# EAGLE design Strombegrenzung_RevB (EAGLE 7.4.0)
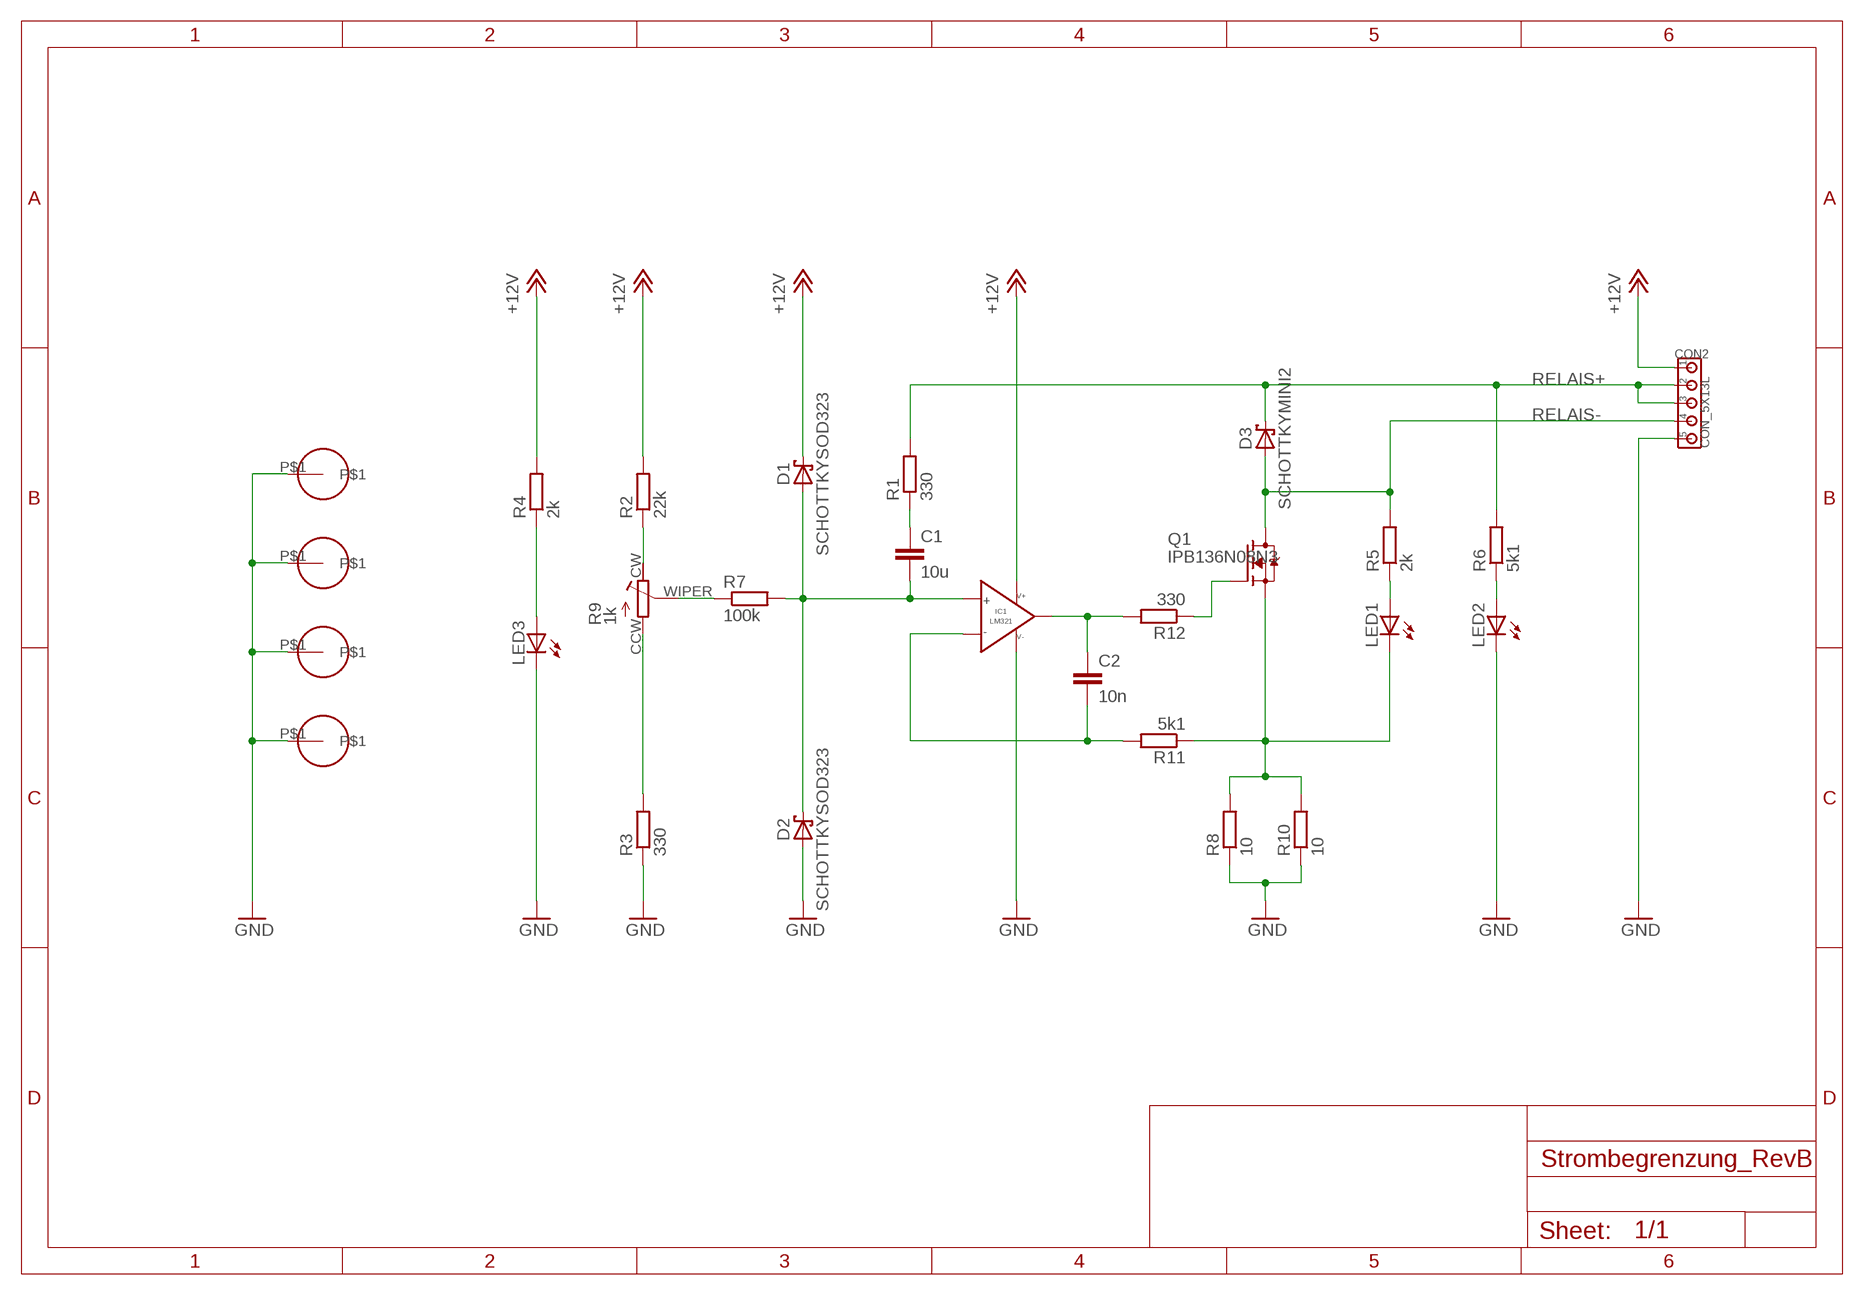
[diagram p0: schematic, sheet 1]

## Parts
C1  10u  CC1206  [C1206]
C2  10n  CC0805  [C0805]
CON2  CON_5X13L  [200MIL_5X]
D1  SCHOTTKYSOD323  [SOD323]
D2  SCHOTTKYSOD323  [SOD323]
D3  SCHOTTKYMINI2  [MINI2-F3-B]
IC1  LM321  [SOT-23-5]
LED1  LED0805  [LED0805]
LED2  LED0805  [LED0805]
LED3  LED0805  [LED0805]
Q1  IPB136N08N3  N-PWR-MOSFETTO263-3  [TO263-3]
R1  330  RESISTORR0805  [R0805]
R2  22k  RESISTORR0805  [R0805]
R3  330  RESISTORR0805  [R0805]
R4  2k  RESISTORR0805  [R0805]
R5  2k  RESISTORR0805  [R0805]
R6  5k1  RESISTORR0805  [R0805]
R7  100k  RESISTORR0805  [R0805]
R8  10  RESISTORR0805  [R0805]
R9  1k  TRIMMER3314G  [RTRIM3314G]
R10  10  RESISTORR0805  [R0805]
R11  5k1  RESISTORR0805  [R0805]
R12  330  RESISTORR0805  [R0805]
U$1  HOLE_3.3MM  [HOLE_3.3MM]
U$2  HOLE_3.3MM  [HOLE_3.3MM]
U$3  HOLE_3.3MM  [HOLE_3.3MM]
U$4  HOLE_3.3MM  [HOLE_3.3MM]

## Nets
+12V: CON2.1 D1.C IC1.5(V+) R2.2 R4.2
GND: CON2.5 D2.A IC1.2(V-) LED2.C LED3.C R3.1 R8.1 R10.1 U$1.P$1 U$2.P$1 U$3.P$1 U$4.P$1
N$1: C1.1 R1.1
N$2: R7.1 R9.WIPER
N$3: C1.2 D1.A D2.C IC1.1(IN+) R7.2
N$4: Q1.1(G) R12.1
N$5: LED1.A R5.1
N$6: LED3.A R4.1
N$7: C2.2 IC1.3(IN-) R11.2
N$8: R2.1 R9.CW
N$9: R3.2 R9.CCW
N$10: C2.1 IC1.4(VOUT) R12.2
N$20: LED1.C Q1.3(S) R8.2 R10.2 R11.1
R6: LED2.A R6.1
RELAIS+: CON2.2 CON2.3 D3.C R1.2 R6.2
RELAIS-: CON2.4 D3.A Q1.TAB(D) R5.2

## Library data of the parts
C1 C2 = 00Capacitor:C: Capacitor
CON2 = 00Connector:CON_5X: 5-pin header
D1-D3 = 00Diode:SCHOTTKY
IC1 = 00OpAmp:LM321: LM321 Low Power Single Operational Amplifier 3-32V
LED1-LED3 = 00Display:LED: LED
Q1 = 00Mosfet:N-PWR-MOSFET
R1-R8 R10-R12 = 00Resistor:RESISTOR: RESISTOR, European symbol
R9 = 00Resistor:TRIMMER
U$1-U$4 = 00Drill:HOLE_3.3MM

## Board
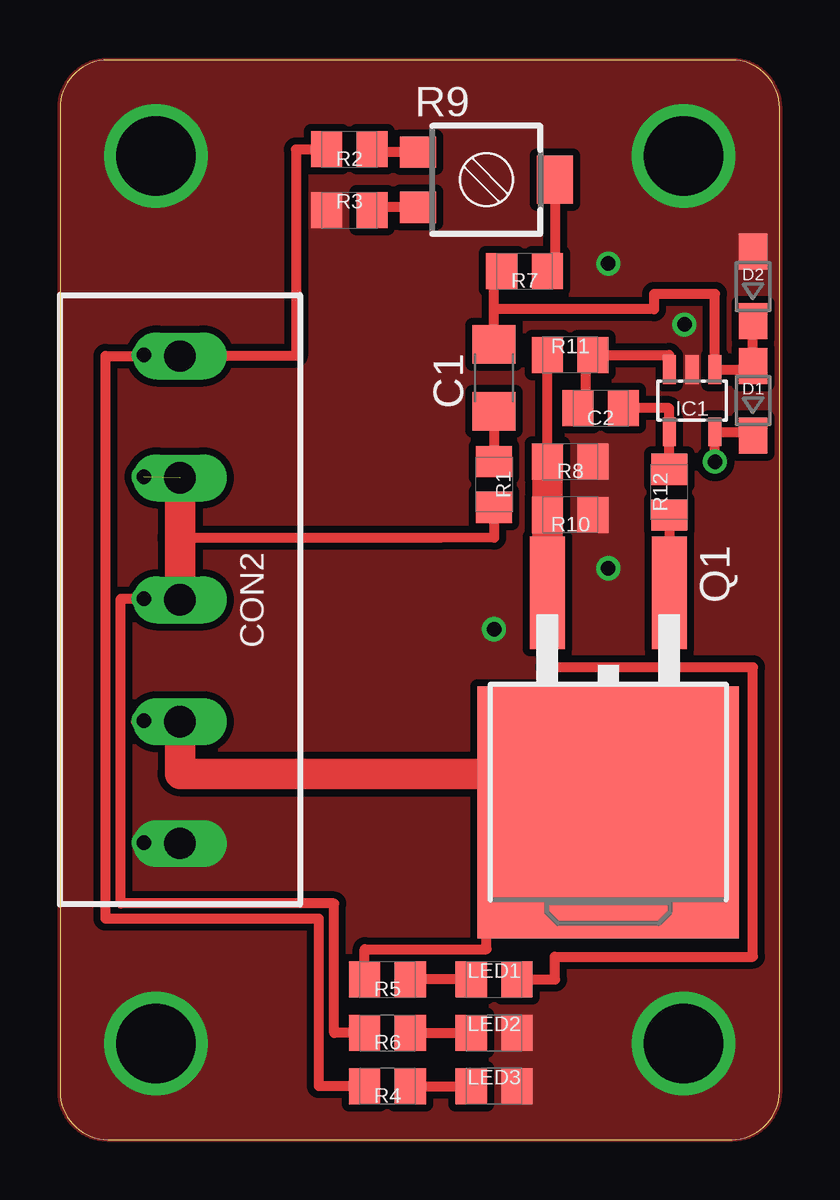
[diagram p1: board, top side]
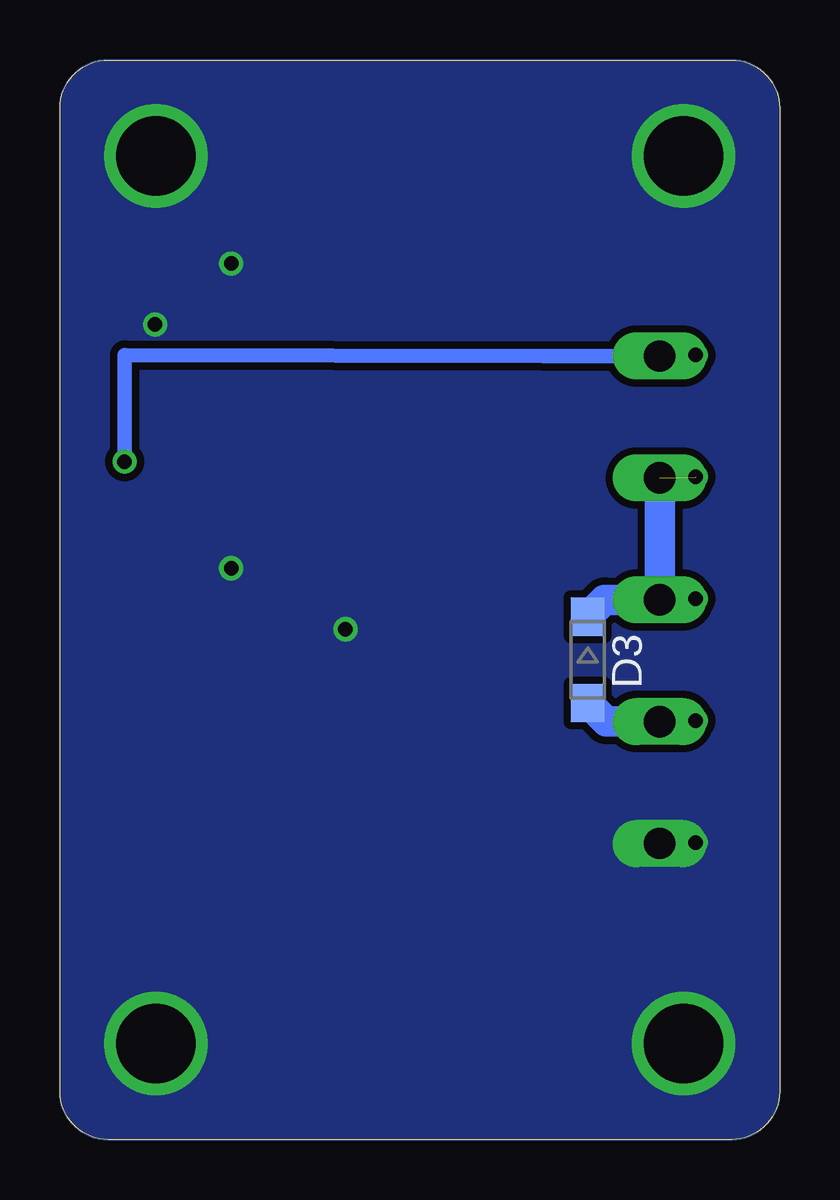
[diagram p2: board, bottom side, seen from below]

Size 30 x 45 mm. Coordinates in mm from the lower left corner, seen from the top.
Outline: 2,0 28,0 arc90 30,2 30,43 arc90 28,45 2,45 arc90 0,43 0,2 arc90 2,0
Copper layers (1*16): Top 0.035mm / dielectric 1.5mm / Bottom 0.035mm
Design rules "default *": minimum track width 10mil, minimum drill 0.6mm, track to track 8mil, track to pad 8mil, pad to pad 8mil, via to via 8mil, smd to smd 8mil, copper to edge 0mil, drill to drill 8mil, minimum pad ring 10mil, minimum via ring 8mil, stop-mask expansion 4mil, vias tented up to drill 0mil, thermal gap 10mil

### Footprints (pad centres in the part's own frame; a part is rotated, then mirrored left to right if it is on the bottom)
C1206 = smd 1.6 x 1.8: 1 -1.4,0; 2 1.4,0
C0805 = smd 1.3 x 1.5: 1 -0.95,0; 2 0.95,0
200MIL_5X = drill 1.3 long: 1 -10.16,0; 2 -5.08,0; 3 0,0; 4 5.08,0; 5 10.16,0
SOD323 = smd 1.5 x 1.2: A 1.45,0; C -1.45,0
MINI2-F3-B = smd 1.6 x 1.4: A 1.8,0; C -1.8,0
SOT-23-5 = smd 0.55 x 1.2: 1 -0.95,-1.3; 2 0,-1.3; 3 0.95,-1.3; 4 0.95,1.3; 5 -0.95,1.3
LED0805 = smd 1.3 x 1.5: A -0.95,0; C 0.95,0
TO263-3 = smd 1.45 x 4.7: 1 -2.54,-5.65; 3 2.54,-5.65 | smd 10.9 x 10.5: TAB 0,3.5
R0805 = smd 1.3 x 1.5: 1 -0.95,0; 2 0.95,0
RTRIM3314G = smd 1.3 x 1.5: CCW 1.15,-2.85; CW -1.15,-2.85 | smd 2 x 1.5: WIPER 0,2.85
HOLE_3.3MM = drill 3.3: P$1 0,0

### Placement (x,y rotation side)
C1  18.1,31.75 90 top
C2  22.54,30.48 180 top
CON2  5,22.5 270 top
D1  28.89,30.8 90 top
D2  28.89,35.56 90 top
D3  8,20 270 bottom
IC1  26.35,30.8 180 top
LED1  18.1,6.67 0 top
LED2  18.1,4.45 0 top
LED3  18.1,2.22 0 top
Q1  22.86,17.14 180 top
R1  18.1,27.3 270 top
R2  12.06,41.27 180 top
R3  12.06,38.73 0 top
R4  13.65,2.22 180 top
R5  13.65,6.67 180 top
R6  13.65,4.45 180 top
R7  19.37,36.2 180 top
R8  21.27,28.26 180 top
R9  17.78,40.01 270 top
R10  21.27,26.04 180 top
R11  21.27,32.7 0 top
R12  25.4,26.99 90 top
U$1  4,41 0 top
U$2  4,4 0 top
U$3  26,41 0 top
U$4  26,4 0 top

### Tracks (layer width: path | path; a pad name or v marks a point on that pad's centre or on a via)
+12V  (via drill 0.6)
  Top 0.406: 28.89,29.5 IC1.5 27.3,28.57 v27.3,28.26 | R2.2 9.84,41.27 9.84,32.66 CON2.1 | R4.2 10.79,2.22 10.79,9.21 1.91,9.21 1.91,32.66 CON2.1 | v3.49,32.7 3.17,32.66 CON2.1
  Top 0.61: 28.89,29.5 D1.C
  Bottom 0.61: CON2.1 9.84,32.66 27.3,32.7 v27.3,28.26
GND  (via drill 0.6)
  other vias: 22.86,23.81 3.49,12.38 18.1,21.27 22.86,36.51 26.04,33.97
  pour Top (isolate 0.3, no thermals): 0,2 0,43 arc-90 2,45 28,45 arc-90 30,43 30,2 arc-90 28,0 2,0 arc-90
  pour Bottom (isolate 0.305, no thermals): 0,40 0,43 arc-90 2,45 15,45 28,45 arc-90 30,43 30,25 30,2 arc-90 28,0 15,0 2,0 arc-90 0,2
N$1
  Top 0.406: C1.1 R1.1
N$2
  Top 0.406: R9.WIPER 20.64,36.2 R7.1
N$3
  Top 0.406: 28.89,32.1 IC1.1 27.3,35.24 24.77,35.24 24.77,34.61 18.1,34.61 | D1.A D2.C | C1.2 18.1,34.61 | 18.1,34.61 18.1,36.2 R7.2
  Top 0.61: 28.89,32.1 D1.A
N$4
  Top 0.406: R12.1 Q1.1
N$5
  Top 0.406: LED1.A R5.1
N$6
  Top 0.406: R4.1 LED3.A
N$7
  Top 0.406: C2.2 21.91,30.48 21.91,32.7 R11.2 25.4,32.7 IC1.3
N$8
  Top 0.406: R9.CW 13.02,41.16 R2.1
N$9
  Top 0.406: R9.CCW 13.02,38.85 R3.2
N$10
  Top 0.406: R12.2 IC1.4 25.4,30.48 C2.1
N$20
  Top 0.406: LED1.C 20.64,6.67 20.64,7.62 28.89,7.62 28.89,19.68 20.32,19.68 Q1.3 | R8.2 R11.1
  Top 1.27: R8.2 R10.2 20.32,26.35 Q1.3
R6
  Top 0.406: R6.1 LED2.A
RELAIS+  (via drill 0.6)  (1 unrouted)
  Top 0.406: R6.2 11.43,4.45 11.43,9.84 2.54,9.84 2.54,22.54 v3.49,22.54 5,22.54 | R1.2 18.1,25.09 15.88,25.08 5,25.08
  Top 1.27: CON2.2 5,25.08 5,22.54 CON2.3
  Bottom 1.27: CON2.2 5,22.54 5.08,22.54 | D3.C 7.3,22.5 CON2.3
  other vias: 3.49,27.62
RELAIS-  (via drill 0.6)
  Top 0.406: R5.2 12.7,7.94 17.78,7.94 17.78,9.53 18.41,14.6 18.73,14.6 Q1.TAB | v3.49,17.46 3.17,17.42 CON2.4
  Top 0.61: 18.73,15.24 18.73,14.6
  Top 1.27: CON2.4 5,15.24 18.73,15.24
  Bottom 1.27: D3.A 7.22,17.42 CON2.4

### Text on the board
tText: 12V | IN | R+ | R- | GND